# Altium schematic sheet mcu_debug.SchDoc: ARM debug probe
size A4; Author: Pavel Koupý; Revision: 1.0
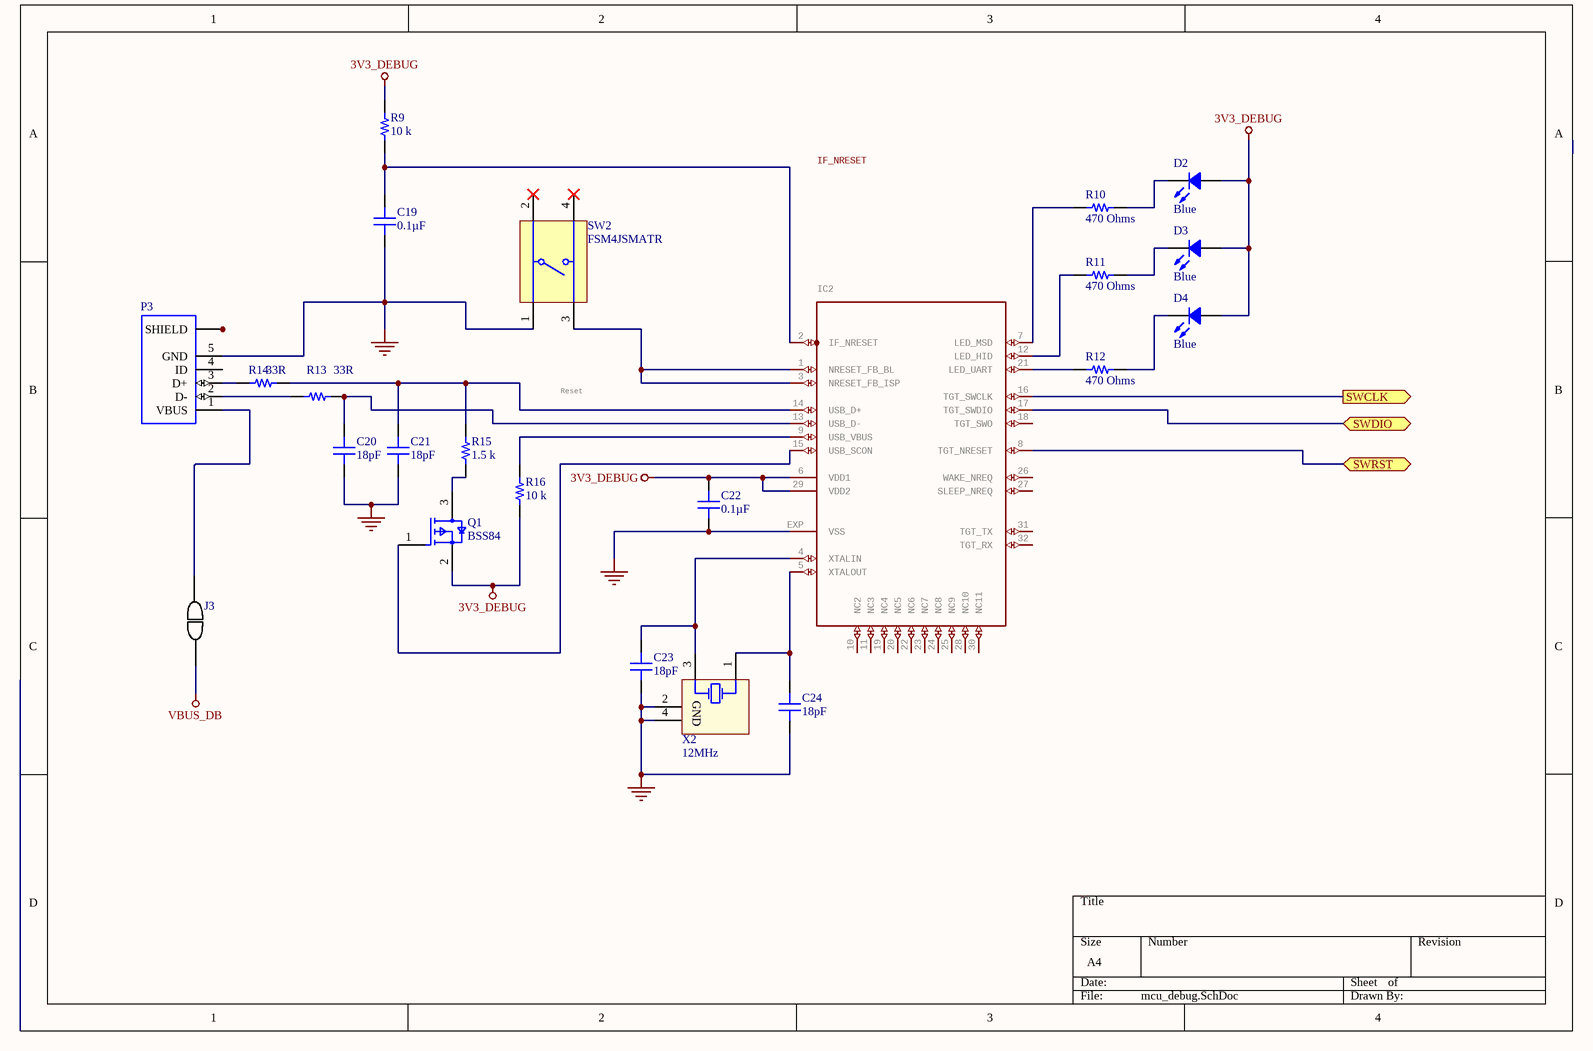
[diagram p0: mcu_debug.SchDoc]

## Parts
C19  0.1µF  [CAP 0603_1608]
C20  18pF  [CAP 0603_1608]
C21  18pF  [CAP 0603_1608]
C22  0.1µF  [CAP 0603_1608]
C23  18pF  [CAP 0603_1608]
C24  18pF  [CAP 0603_1608]
D2  Blue  [LED 0603_1608 BLUE]
D3  Blue  [LED 0603_1608 BLUE]
D4  Blue  [LED 0603_1608 BLUE]
IC2  CMSIS-DAP Interface : 32-bit LPC11U00 ARM Cortex M3 RISC 64KB Flash 2.5V/3.3V 33-Pin HVQFN EP  [HVQFN33]  (value not drawn)
J3  103185-2  [TE_103185-2]  (value not drawn)
P3  47346-0001  [MOLEX_47346-0001]  (value not drawn)
Q1  BSS84  [FP-SOT23-MFG]
R9  10 k  [RES 0603_1608]
R10  470 Ohms  [RES 0603_1608]
R11  470 Ohms  [RES 0603_1608]
R12  470 Ohms  [RES 0603_1608]
R13  33R  [RES 0603_1608]
R14  33R  [RES 0603_1608]
R15  1.5 k  [RES 0603_1608]
R16  10 k  [RES 0603_1608]
SW2  FSM4JSMATR  [TECO-FSM4JSMATR_V]
X2  12MHz  [ABRA-ABMM2-4_V]

## Ports
SWCLK (out), SWDIO (bidir), SWRST (bidir)

## Nets
3V3_DEBUG: C22.2 D2.1 D3.1 D4.1 IC2.6(VDD1) IC2.29(VDD2) Q1.2(S) R9.2 R16.1
GND: C19.1 C20.1 C21.1 C22.1 C23.1 C24.1 IC2.EXP(VSS) P3.5(GND) SW2.1 X2.2(GND) X2.4(GND)
VBUS_DB: J3.1
SWCLK: IC2.16(TGT_SWCLK) ; port SWCLK
SWDIO: IC2.17(TGT_SWDIO) ; port SWDIO
SWRST: IC2.8(TGT_NRESET) ; port SWRST
NetC19_2: C19.2 IC2.2(IF_NRESET) R9.1
NetC20_2: C20.2 IC2.13(USB_D-) R13.2
NetC21_2: C21.2 IC2.14(USB_D+) R14.2 R15.2
NetC23_2: C23.2 IC2.4(XTALIN) X2.3(X2)
NetC24_2: C24.2 IC2.5(XTALOUT) X2.1(X1)
NetD2_2: D2.2 R10.2
NetD3_2: D3.2 R11.2
NetD4_2: D4.2 R12.2
NetIC2_1: IC2.1(NRESET_FB_BL) IC2.3(NRESET_FB_ISP) SW2.3
NetIC2_7: IC2.7(LED_MSD) R10.1
NetIC2_9: IC2.9(USB_VBUS) R16.2
NetIC2_12: IC2.12(LED_HID) R11.1
NetIC2_15: IC2.15(USB_SCON) Q1.1(G)
NetIC2_21: IC2.21(LED_UART) R12.1
NetJ3_2: J3.2 P3.1(VBUS)
NetP3_2: P3.2(D-) R13.1
NetP3_3: P3.3(D+) R14.1
NetP3_SH1: P3.SH1(SHIELD) P3.SH2(SHIELD) P3.SH3(SHIELD) P3.SH4(SHIELD) P3.SH5(SHIELD) P3.SH6(SHIELD)
NetQ1_3: Q1.3(D) R15.1

Not connected (* = marked no-connect by the designer): IC2 10(NC2) 11(NC3) 18(TGT_SWO) 19(NC4) 20(NC5) 22(NC6) 23(NC7) 24(NC8) 25(NC9) 26(WAKE_NREQ) 27(SLEEP_NREQ) 28(NC10) 30(NC11) 31(TGT_TX) 32(TGT_RX); P3 4(ID); SW2 2* 4*

## Notes on the sheet
- Reset
- Labels drawn without touching a wire or pin: IF_NRESET

## Library data of the parts
C19 C22 = C0603T104K8RAC7867: CAP CER 0.1UF 10V X7R 0603; Manufacturer: KEMET; Ratings: COTS; Tolerance: ±10%; Part Number: C0603T104K8RAC7867; Value: 0.1µF; Applications: High Reliability, Bypass, Decoupling; Capacitance: 0.1µF; ComponentLink1Description: Datasheet; ComponentLink1URL: https://api.kemet.com/component-edge/download/datasheet/C0603T104K8RAC7867.pdf; ComponentLink2Description: DigiKey Link; ComponentLink2URL: http://digikey.com/product-detail/en/kemet/C0603T104K8RAC7867/399-20424-1-ND/9925028; Device Package: 0603 (1608 Metric); LastUpdated: 02.09.2020 1:03:35; Lifecycle Status: Active; Minimum Order: 1; Mounting Type: Surface Mount, MLCC; Operating Temperature: -55°C ~ 125°C; Package / Case: 0603 (1608 Metric); Packaging: TapeAndReel; PartId: 2528; Part Status: Active; Price: 0.23; Series: SMD COTS X7R; Size / Dimension: 0.063" L x 0.031" W (1.60mm x 0.80mm); Supplier 1: DigiKey; Supplier Part Number 1: 399-20424-1-ND; Temperature Coefficient: X7R; Thickness (Max): 0.034" (0.87mm); Voltage - Rated: 10V
C20 C21 C23 C24 = VJ0603A180FXQCW1BC: CAP CER 18PF 10V C0G/NP0 0603; Manufacturer: Vishay Vitramon; Temperature Coefficient: C0G, NP0; Tolerance: ±1%; Part Number: VJ0603A180FXQCW1BC; Value: 18pF; Applications: General Purpose; Capacitance: 18pF; ComponentLink1Description: Datasheet; ComponentLink1URL: https://www.vishay.com/docs/28548/vjw1bcbascomseries.pdf; ComponentLink2Description: DigiKey Link; ComponentLink2URL: http://digikey.com/product-detail/en/vishay-vitramon/VJ0603A180FXQCW1BC/720-1660-1-ND/8324080; Device Package: 0603 (1608 Metric); LastUpdated: 02.09.2020 1:03:27; Lifecycle Status: Active; Minimum Order: 1; Mounting Type: Surface Mount, MLCC; Operating Temperature: -55°C ~ 125°C; Package / Case: 0603 (1608 Metric); Packaging: TapeAndReel; PartId: 7094; Part Status: Active; Price: 0.04; Series: VJ; Size / Dimension: 0.063" L x 0.031" W (1.60mm x 0.80mm); Supplier 1: DigiKey; Supplier Part Number 1: 720-1660-1-ND; Thickness (Max): 0.034" (0.87mm); Voltage - Rated: 10V
D2-D4 = VLMB1300-GS08: LED BLUE 0603 SMD; Manufacturer: Vishay Semiconductor Opto Division; Configuration: Standard; Current - Test: 20mA; Lens Color: 1.00mm; Lens Size: 1.10mm x 0.80mm; Lens Style: Rectangle with Flat Top; Millicandela Rating: 104mcd; Viewing Angle: 130°; Voltage - Forward (Vf) (Typ): 3.3V; Wavelength - Dominant: 470nm; Wavelength - Peak: 468nm; Part Number: VLMB1300-GS08; Color: Blue; ComponentLink1Description: Datasheet; ComponentLink1URL: http://www.vishay.com/docs/82437/vlmo1300.pdf; ComponentLink2Description: DigiKey Link; ComponentLink2URL: http://digikey.com/product-detail/en/vishay-semiconductor-opto-division/VLMB1300-GS08/VLMB1300-GS08CT-ND/3025485; Device Package: 0603 (1608 Metric); Height (Max): 1.00mm; LastUpdated: 02.09.2020 1:20:26; Lifecycle Status: Active; Minimum Order: 1; Mounting Type: Surface Mount; Package / Case: 0603 (1608 Metric); Packaging: TapeAndReel; PartId: 785; Part Status: Active; Price: 0.08; Series: CHIPLED; Size / Dimension: 1.60mm L x 0.80mm W; Supplier 1: DigiKey; Supplier Part Number 1: VLMB1300-GS08CT-ND; Supplier Device Package: 0603; Value: Blue
IC2 = IF_LPC11U35FHI33/501: GateName_1: G$1; SymbolName_1: IF-LPC11U35; MF: NXP; LibraryName: mbed-HDK-MF-NXP; DeviceSetName: IF_LPC11U35FHI33/501; Package: HVQFN33; MFN: LPC11U35FHI33/501; OC-DIGIKEY: 568-9586-ND; OC-MOUSER: 771-LPC11U35FHI33501; OC-NEWARK: 2115658; Supplier 1: Farnell; Supplier Part Number 1: 2115658
J3 = 103185-2: 02 MODII HDR SRST B/A .100CL; Package: None; Price: None; Value: *; MP: 103185-2; Availability: Unavailable
P3 = 47346-0001: CONN RCPT 5POS MICRO USB R/A  SMD; Value: *; Supplier 1: Farnell; Supplier Part Number 1: 1568026; Supplier 2: Mouser; Supplier Part Number 2: 538-47346-0001
Q1 = CMP-14409-000006-1: MOSFET P-CH 50V 130MA SOT-23; Manufacturer Part Number: BSS84,215; Manufacturer: Nexperia USA Inc.; Drain To Source Breakdown Voltage: -50V; Max Junction Temp: +150°C; Threshold Vgs Min: -0.8V; Turn On Delay Time: 3ns; Power Dissipation: 250mW; Turn Off Delay Time: 7ns; Gate To Source Voltage: 20V; Number Of Channels: 1; Input Capacitace At Vds: 25pF @ -25V; Threshold Vgs Max: -2V; Continuous Drain Current: -130mA; Depletion Mode: False; Drain To Source Resistance: 6Ω; Rthja Max: 500K/W; Octopart: https://octopart.com/bss84%2C215-nexperia-78739375; Ipc Land Pattern Name: SOT95P230X100-3; Drain To Source Voltage: -50V; Lead Free: Yes; Temperature Range High: +150°C; Automotive: No; Device Class L2: Transistors; Package: SOT23; ComponentLink2URL: https://assets.nexperia.com/documents/data-sheet/BSS84.pdf; Category: Trans; RoHS: TRUE; Temperature Range Low: -65°C; ComponentLink2Description: Datasheet; Device Class L1: Discrete Semiconductors; Number Of P Channels: 1; Device Class L3: MOSFETs; Height: 1.1mm; Digikey Description: MOSFET P-CH 50V 130MA SOT-23; Temperature: -65°C to +150°C; Footprint Url: https://assets.nexperia.com/documents/outline-drawing/SOT23.pdf
R9 R16 = RNCS0603BKE10K0: RES 10K OHM 0.1% 1/16W 0603; Manufacturer: Stackpole Electronics Inc; Power (Watts): 0.063W, 1/16W; Resistance: 10 kOhms; Temperature Coefficient: ±25ppm/°C; Part Number: RNCS0603BKE10K0; Value: 10 k; ComponentLink1Description: Datasheet; ComponentLink1URL: https://www.seielect.com/catalog/sei-rncs_rnch.pdf; ComponentLink2Description: DigiKey Link; ComponentLink2URL: http://digikey.com/product-detail/en/stackpole-electronics-inc/RNCS0603BKE10K0/RNCS0603BKE10K0CT-ND/1800113; Composition: Thin Film; Device Package: 0603 (1608 Metric); Features: Anti-Corrosive, Automotive AEC-Q200, Moisture Resistant; Height - Seated (Max): 0.022" (0.55mm); LastUpdated: 02.09.2020 1:10:25; Lifecycle Status: Active; Minimum Order: 1; Number of Terminations: 2; Operating Temperature: -55°C ~ 155°C; Package / Case: 0603 (1608 Metric); Packaging: TapeAndReel; PartId: 4838; Part Status: Active; Price: 0.08; Ratings: AEC-Q200; Series: RNCS; Size / Dimension: 0.061" L x 0.031" W (1.55mm x 0.80mm); Supplier 1: DigiKey; Supplier Part Number 1: RNCS0603BKE10K0CT-ND; Supplier Device Package: 0603; Tolerance: ±0.1%
R10-R12 = CRCW0603470RJNEAHP: RES SMD 470 OHM 5% 1/4W 0603; Manufacturer: Vishay Dale; Power (Watts): 0.25W, 1/4W; Temperature Coefficient: ±200ppm/°C; Part Number: CRCW0603470RJNEAHP; Value: 470 Ohms; ComponentLink1Description: Datasheet; ComponentLink1URL: http://www.vishay.com/docs/20043/crcwhpe3.pdf; ComponentLink2Description: DigiKey Link; ComponentLink2URL: http://digikey.com/product-detail/en/vishay-dale/CRCW0603470RJNEAHP/541-470SACT-ND/2222809; Composition: Thick Film; Device Package: 0603 (1608 Metric); Features: Automotive AEC-Q200, Pulse Withstanding; Height - Seated (Max): 0.022" (0.55mm); LastUpdated: 02.09.2020 1:09:49; Lifecycle Status: Active; Minimum Order: 1; Number of Terminations: 2; Operating Temperature: -55°C ~ 155°C; Package / Case: 0603 (1608 Metric); Packaging: TapeAndReel; PartId: 21320; Part Status: Active; Price: 0.02; Ratings: AEC-Q200; Resistance: 470 Ohms; Series: CRCW-HP; Size / Dimension: 0.063" L x 0.033" W (1.60mm x 0.85mm); Supplier 1: DigiKey; Supplier Part Number 1: 541-470SACT-ND; Supplier Device Package: 0603; Tolerance: ±5%
R13 R14 = CPF0603B33RE: RES SMD 33 OHM 0.1% 1/16W 0603; Manufacturer: TE Connectivity Passive Product; Power (Watts): 0.063W, 1/16W; Resistance: 33 Ohms; Temperature Coefficient: ±25ppm/°C; Part Number: CPF0603B33RE; Value: 33R; ComponentLink1Description: Datasheet; ComponentLink1URL: https://www.te.com/commerce/DocumentDelivery/DDEController?Action=srchrtrv&DocNm=1773200&DocType=DS&DocLang=English; ComponentLink2Description: DigiKey Link; ComponentLink2URL: http://digikey.com/product-detail/en/te-connectivity-passive-product/CPF0603B33RE/A119909CT-ND/4966507; Composition: Thin Film; Device Package: 0603 (1608 Metric); Height - Seated (Max): 0.022" (0.55mm); LastUpdated: 02.09.2020 1:10:25; Lifecycle Status: Active; Minimum Order: 1; Number of Terminations: 2; Operating Temperature: -55°C ~ 155°C; Package / Case: 0603 (1608 Metric); Packaging: TapeAndReel; PartId: 4881; Part Status: Active; Price: 0.09; Series: CPF, Neohm; Size / Dimension: 0.061" L x 0.031" W (1.55mm x 0.80mm); Supplier 1: DigiKey; Supplier Part Number 1: A119909CT-ND; Supplier Device Package: 0603; Tolerance: ±0.1%
R15 = CRGP0603F1K5: CRGP 0603 1K5 1%; Manufacturer: TE Connectivity Passive Product; Power (Watts): 0.25W, 1/4W; Resistance: 1.5 kOhms; Temperature Coefficient: ±100ppm/°C; Part Number: CRGP0603F1K5; Value: 1.5 k; ComponentLink1Description: Datasheet; ComponentLink1URL: https://www.te.com/commerce/DocumentDelivery/DDEController?Action=srchrtrv&DocNm=9-1773463-9&DocType=DS&DocLang=English; ComponentLink2Description: DigiKey Link; ComponentLink2URL: http://digikey.com/product-detail/en/te-connectivity-passive-product/CRGP0603F1K5/A130418CT-ND/8578250; Composition: Thick Film; Device Package: 0603 (1608 Metric); Features: Pulse Withstanding; Height - Seated (Max): 0.022" (0.55mm); LastUpdated: 02.09.2020 1:10:24; Lifecycle Status: Active; Minimum Order: 1; Number of Terminations: 2; Operating Temperature: -55°C ~ 155°C; Package / Case: 0603 (1608 Metric); Packaging: TapeAndReel; PartId: 5000; Part Status: Active; Price: 0.02; Series: CRGP; Size / Dimension: 0.063" L x 0.031" W (1.60mm x 0.80mm); Supplier 1: DigiKey; Supplier Part Number 1: A130418CT-ND; Supplier Device Package: 0603; Tolerance: ±1%
SW2 = CMP-2000-07486-1: Micro Miniature Push Button Switch FSM JSM, 50 mA, -35 to 85 degC, 4-Pin SMD, RoHS, Tape and Reel; Manufacturer: TE Connectivity; Mechanical Life: 100000Cycles; Current Rating: 50mA; Actuator Material: Polyamide; Max Voltage Rating (DC): 12V; Capacitance: 0f; Illumination Type: Illuminated; Voltage Rating (DC): 24V; Case\/Package: SMD/SMT; Operating Force: 160gf; Contact Resistance: 100mOhm; Actuator Length: 0.055inch; Switch Travel: 0.25mm; Throw Configuration: SPST; Termination: GullWing; Contact Plating: Silver; Orientation: Straight; Mounting Technology: SurfaceMount; REACH SVHC: Unknown; Electrical Life: 100000Cycles; Package Reference: FSM4JSMATR; Max Operating Temperature: 85degC; Manufacturer URL: http://www.te.com/; Package Description: 4-Pin Surface Mount Device, Body 6 x 6 mm, Pitch 4.5 mm; Datasheet Version: Rev. V, 02/2015; Packaging: TapeandReel; Min Operating Temperature: -35degC; Mount: SurfaceMount; Contact Current Rating: 50mA; Contact Material: CopperAlloy; Package Quantity: 1200; Datasheet URL: http://www.te.com/commerce/DocumentDelivery/DDEController?Action=showdoc&DocId=Customer+Drawing%7F2-1437565-7%7FV%7Fpdf%7FEnglish%7FENG_CD_2-1437565-7_V.pdf%7F4-1437565-2; RoHSCompliant: true
X2 = CMP-0277-00003-1: Ceramic Surface Mount Low Profile Quartz Crystal, 8 MHz, -20 to 70 degC, 4-Pin 6 x 3.6 x 1.2 mm SMD, RoHS, 1000pcs / Reel; Manufacturer: Abracon; PartNumber: ABMM2-8.000MHZ-E2-T; ESR: 72 Ohm Max.; Frequency: 8 MHz; Shunt Capacitance C0: 7 pF Max.; Load Capacitance CL: 18 pF Typ.; ComponentLink3Description: Package Specification; PackageDescription: 4-Pin SMD, Body 6 x 3.6 mm, Pitch 4.4 mm; DatasheetVersion: Jan-13; ComponentLink1URL: http://www.abracon.com/; ComponentLink2URL: http://www.abracon.com/Resonators/ABMM2.pdf; Temperature Range: -20 to 70 degC; Mounting Technology: Surface Mount; RoHS: TRUE; ComponentLink2Description: Datasheet; ComponentLink3URL: http://www.abracon.com/Resonators/ABMM2.pdf; ComponentLink1Description: Manufacturer URL; Packing: 1000pcs / Reel